# EAGLE design HARTShield (EAGLE 6.4)
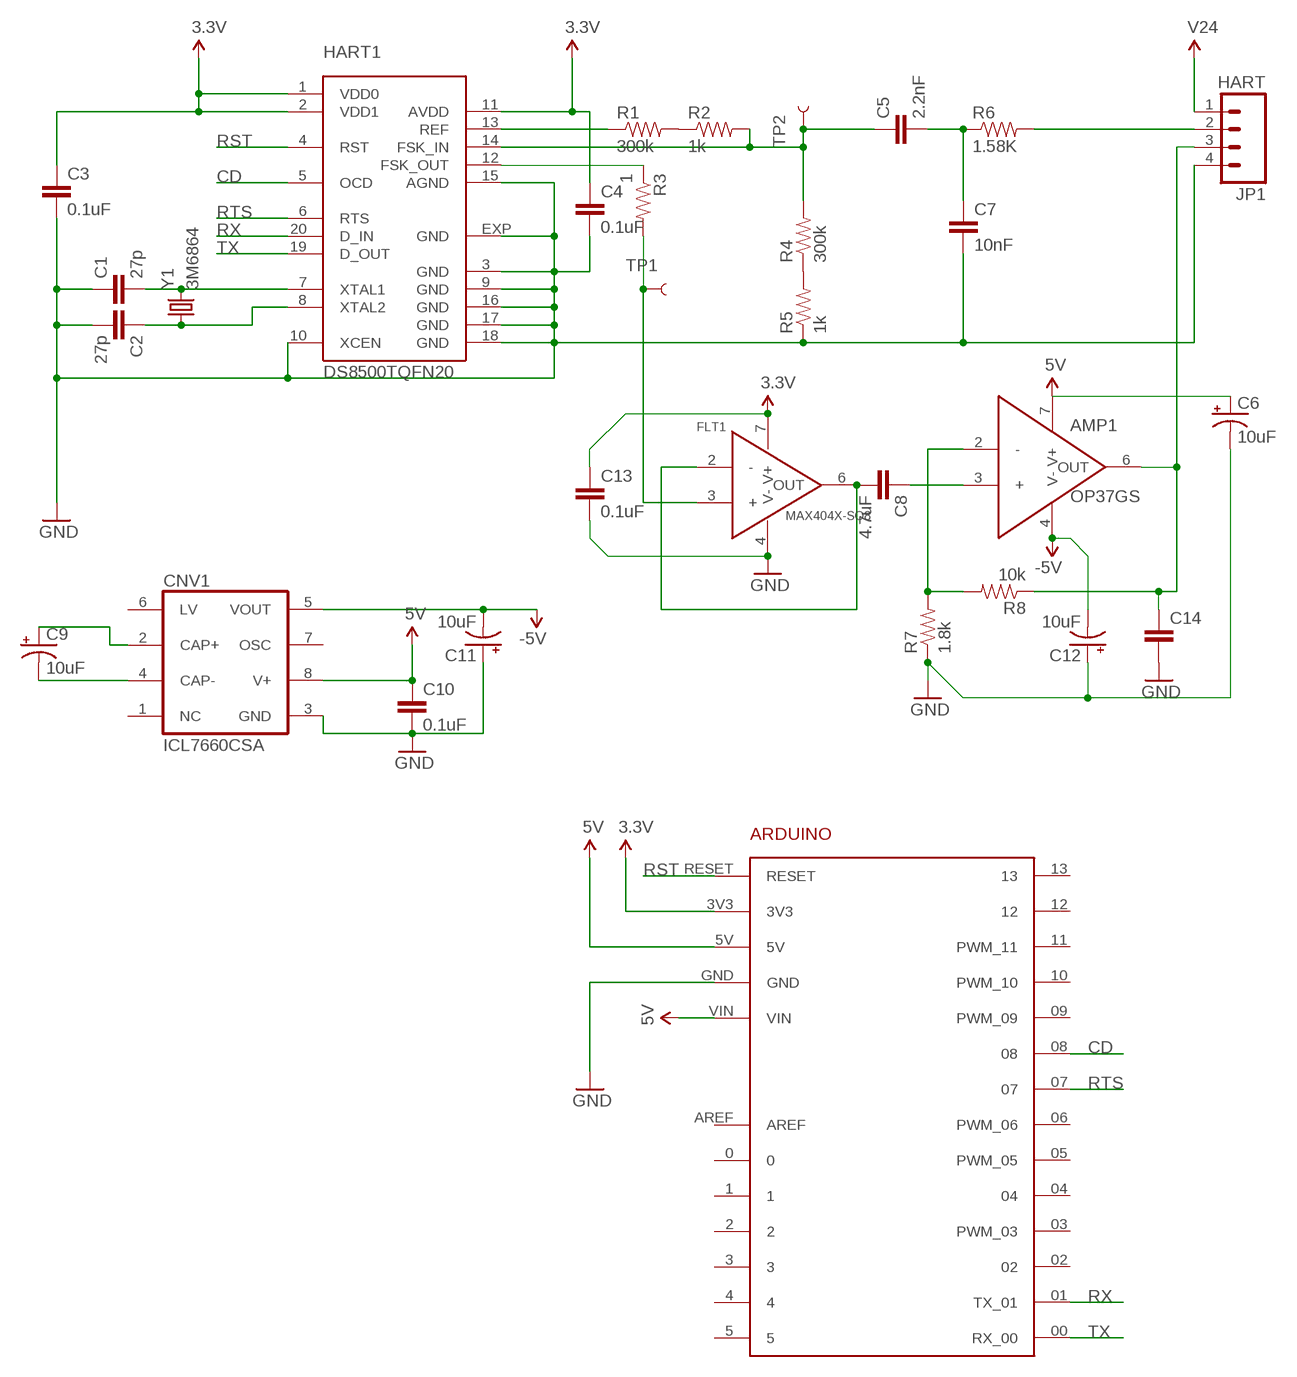
[diagram p0: schematic, sheet 1]

## Parts
AMP1  OP37GS  [SO8]
ARDUINO1  ARDUINO  [ARDUINO]
C1  27p  CAP0603-CAP  [0603-CAP]
C2  27p  CAP0603-CAP  [0603-CAP]
C3  0.1uF  0.1UF-25V(+80/-20%)(0603)  [0603-CAP]
C4  0.1uF  0.1UF-25V(+80/-20%)(0603)  [0603-CAP]
C5  2.2nF  0.1UF-25V(+80/-20%)(0603)  [0603-CAP]
C6  10uF  10UF-TANT  [EIA3216]
C7  10nF  0.1UF-25V(+80/-20%)(0603)  [0603-CAP]
C8  4.7uF  0.1UF-25V(+80/-20%)(0603)  [0603-CAP]
C9  10uF  10UF-TANT  [EIA3216]
C10  0.1uF  0.1UF-25V(+80/-20%)(0603)  [0603-CAP]
C11  10uF  10UF-TANT  [EIA3216]
C12  10uF  10UF-TANT  [EIA3216]
C13  0.1uF  0.1UF-50V-20%(PTH)KIT-EZ  [CAP-PTH-SMALL-KIT]
C14  0.1UF-50V-20%(PTH)KIT-EZ  [CAP-PTH-SMALL-KIT]
CNV1  ICL7660CSA  [SO08]
FLT1  MAX404X-SO8  [SO8]
HART1  DS8500TQFN20  [TQFN20-5X5]
JP1  HART  M04SCREW  [SCREWTERMINAL-3.5MM-4]
R1  300k  RESISTOR0805-RES  [0805]
R2  1k  RESISTOR0805-RES  [0805]
R3  1  RESISTOR1206  [1206]
R4  300k  RESISTOR0805-RES  [0805]
R5  1k  RESISTOR0805-RES  [0805]
R6  1.58K  RESISTOR0603  [0603-RES]
R7  1.8k  RESISTOR0805-RES  [0805]
R8  10k  RESISTOR0805-RES  [0805]
TP1  TEST-POINT2  [PAD.02X.02]
TP2  TEST-POINT2  [PAD.02X.02]
Y1  3M6864  CRYSTALSMD  [HC49UP]

## Nets
3.3V: ARDUINO1.3V3 C3.1 C4.1 C13.1 FLT1.7(V+) HART1.1(VDD0) HART1.2(VDD1) HART1.11(AVDD)
5V: AMP1.7(V+) ARDUINO1.5V ARDUINO1.VIN C6.A(+) C10.1 CNV1.8(V+)
CD: ARDUINO1.08 HART1.5(OCD)
GND: ARDUINO1.GND C1.1 C2.2 C3.2 C4.2 C6.C(-) C7.2 C10.2 C11.A(+) C12.A(+) C13.2 C14.2 CNV1.3(GND) FLT1.4(V-) HART1.3(GND) HART1.9(GND) HART1.10(XCEN) HART1.15(AGND) HART1.16(GND) HART1.17(GND) HART1.18(GND) HART1.EXP(GND) JP1.4 R5.1 R7.1
N$1: C2.1 HART1.8(XTAL2) Y1.1
N$2: C1.2 HART1.7(XTAL1) Y1.2
N$3: R1.2 R2.1
N$4: HART1.13(REF) R1.1
N$5: FLT1.3(+) R3.2 TP1.P$1
N$6: AMP1.3(+) C8.1
N$7: R4.1 R5.2
N$8: C5.1 HART1.14(FSK_IN) R2.2 R4.2 TP2.P$1
N$9: C5.2 C7.1 R6.1
N$10: C8.2 FLT1.2(-) FLT1.6(OUT)
N$11: JP1.2 R6.2
N$14: AMP1.6(OUT) C14.1 JP1.3 R8.1
N$15: AMP1.2(-) R7.2 R8.2
N$16: HART1.12(FSK_OUT) R3.1
N$18: C9.C(-) CNV1.4(CAP-)
N$19: C9.A(+) CNV1.2(CAP+)
RST: ARDUINO1.RESET HART1.4(RST)
RTS: ARDUINO1.07 HART1.6(RTS)
RX: ARDUINO1.01(TX_01) HART1.20(D_IN)
TX: ARDUINO1.00(RX_00) HART1.19(D_OUT)
VCC: JP1.1 ; supply symbol labelled V24
VNEG: AMP1.4(V-) C11.C(-) C12.C(-) CNV1.5(VOUT) ; supply symbol labelled -5V
Unconnected: ARDUINO1.0 ARDUINO1.1 ARDUINO1.02 ARDUINO1.2 ARDUINO1.3 ARDUINO1.03(PWM_03) ARDUINO1.4 ARDUINO1.04 ARDUINO1.5 ARDUINO1.05(PWM_05) ARDUINO1.06(PWM_06) ARDUINO1.09(PWM_09) ARDUINO1.10(PWM_10) ARDUINO1.11(PWM_11) ARDUINO1.12 ARDUINO1.13 ARDUINO1.AREF CNV1.1(NC) CNV1.6(LV) CNV1.7(OSC)

## Library data of the parts
AMP1 = hartmodems:OP37G: Ultraprecision amplifier
ARDUINO1 = post7_arduino:ARDUINO: For creating Arduino shields
C1 C2 = SparkFun-Capacitors:CAP: Capacitor Standard 0603 ceramic capacitor, and 0.1" leaded capacitor.
C3 C4 C10 = SparkFun-Capacitors:0.1UF-25V(+80/-20%)(0603): Ceramic Standard decoupling cap CAP-00810; PROD_ID: CAP-00810
C5 C7 C8 = SparkFun-Capacitors:0.1UF-25V(+80/-20%)(0603): Ceramic Standard decoupling cap CAP-00810; PROD_ID: CAP-00810; VALUE: 0.1uF
C6 C9 C11 C12 = SparkFun-Capacitors:10UF-TANT: 10uF Tantalum SMT CAP-00811- 16V 10% (EIA-3216); PROD_ID: CAP-00811
C13 C14 = SparkFun-Capacitors:0.1UF-50V-20%(PTH): CAP-08370; PROD_ID: CAP-08370
CNV1 = maxim:ICL7660CSA: VOLTAGE CONVERTER; MF: MAXIM; MPN: ICL7660CSA; OC_FARNELL: 9724710; OC_NEWARK: 34C3732
FLT1 = hartmodems:MAX404X: Rail-to-rail precise amp
HART1 = hartmodems:DS8500: Hart Modem
JP1 = SparkFun-Connectors:M04: Header 4 Standard 4-pin 0.1" header. Use with straight break away headers (SKU : PRT-00116), right angle break away headers (PRT-00553), swiss pins (PRT-00743), machine pins (PRT-00117), and female headers (PRT-00115). Molex polarized connector foot print use with SKU : PRT-08231 with associated crimp pins and housings. 1MM SMD Version SKU: PRT-10208
R1-R8 = SparkFun-Resistors:RESISTOR: Resistor Basic schematic elements and footprints for 0603, 1206, and PTH resistors.
TP1 TP2 = SparkFun-Passives:TEST-POINT: Bare copper test points for troubleshooting or ICT
Y1 = SparkFun-FreqCtrl:CRYSTAL: Various standard crystals. Proven footprints. Spark Fun Electronics SKU : COM-00534

## Board
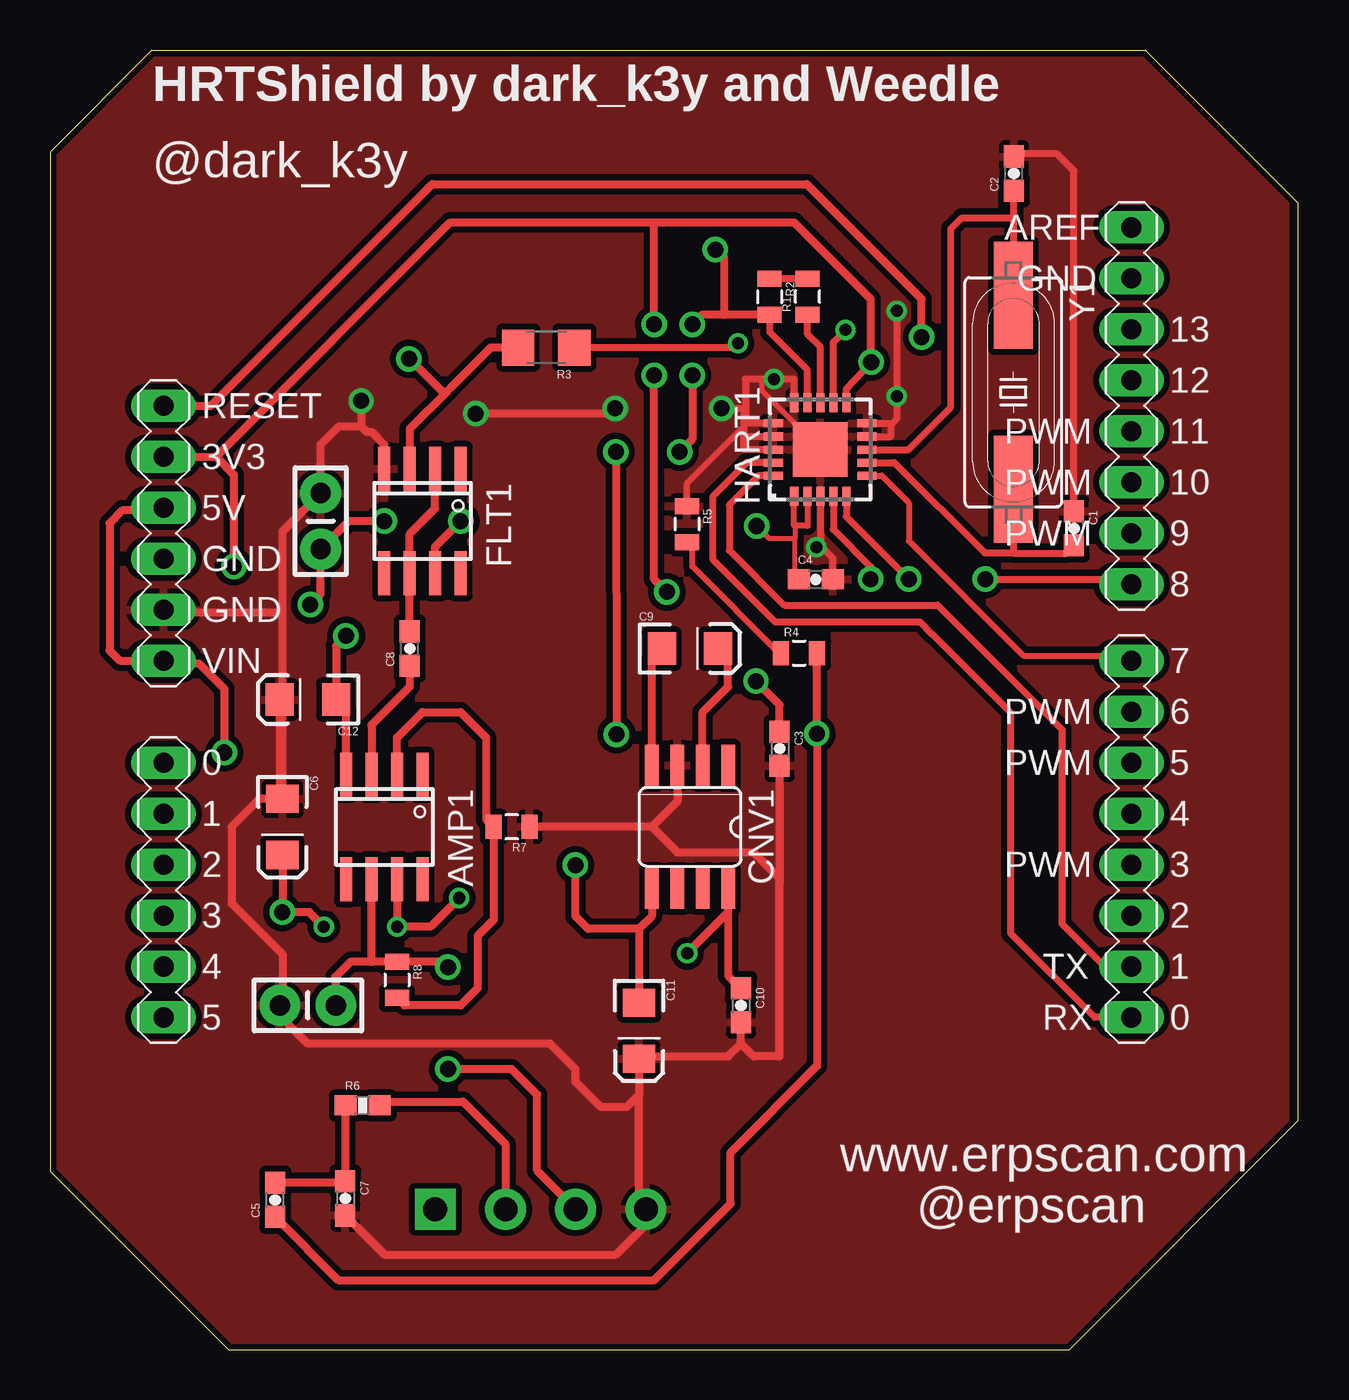
[diagram p1: board, top side]
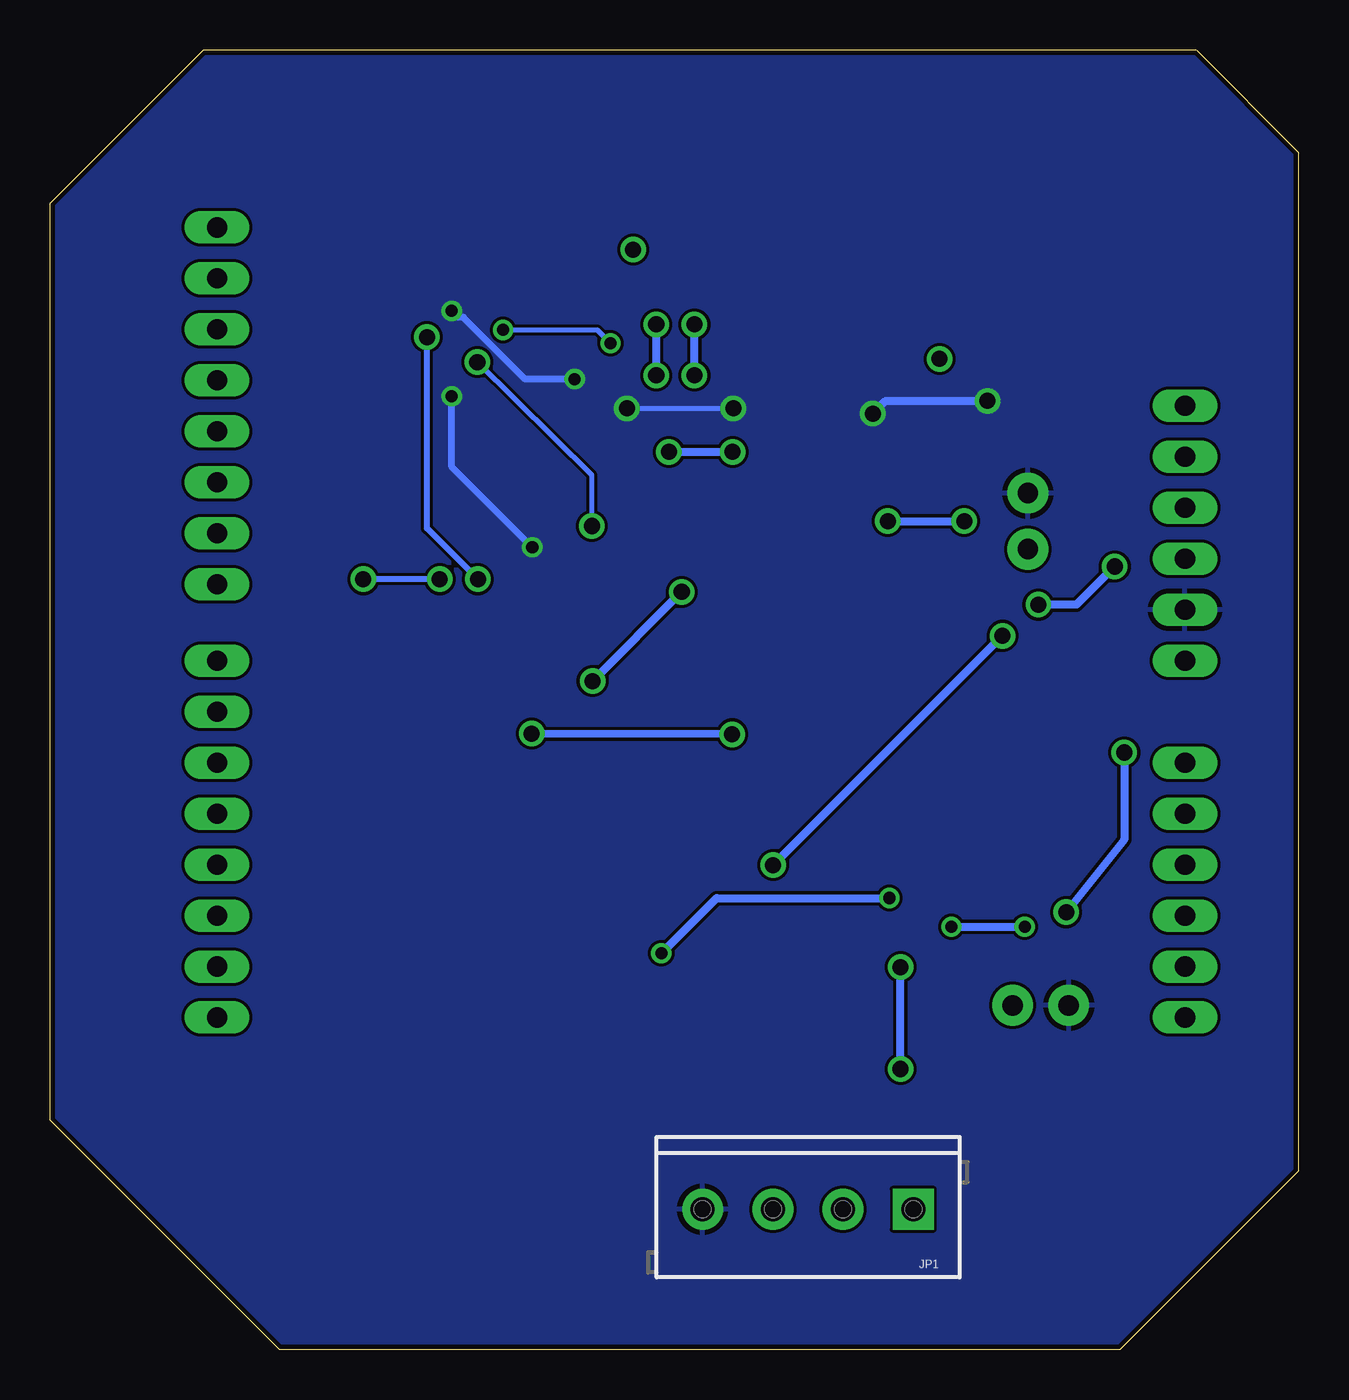
[diagram p2: board, bottom side, seen from below]

Size 62.23 x 64.77 mm. Coordinates in mm from the lower left corner, seen from the top.
Outline: 5.08,64.77 54.61,64.77 62.23,57.15 62.23,11.43 50.8,0 8.89,0 0,8.89 0,59.69 5.07,64.77
Copper layers (1*16): Top 0.035mm / dielectric 1.5mm / Bottom 0.035mm
Design rules "DFRobot_Eagle_Rule_v0.4": minimum track width 6mil, minimum drill 12mil, track to track 6mil, track to pad 6mil, pad to pad 6mil, via to via 6mil, smd to smd 0mil, copper to edge 10mil, drill to drill 10mil, minimum pad ring 12mil, minimum via ring 8mil, stop-mask expansion 2mil, vias tented up to drill 25mil, thermal gap 10mil

### Footprints (pad centres in the part's own frame; a part is rotated, then mirrored left to right if it is on the bottom)
SO8 = smd 0.6 x 2.2: 1 -1.905,-2.6; 2 -0.635,-2.6; 3 0.635,-2.6; 4 1.905,-2.6; 5 1.905,2.6; 6 0.635,2.6; 7 -0.635,2.6; 8 -1.905,2.6
ARDUINO = drill 1 long: 00 25.4,-20.32; 0 -22.86,-7.62; 01 25.4,-17.78; 1 -22.86,-10.16; 02 25.4,-15.24; 2 -22.86,-12.7; 03 25.4,-12.7; 3 -22.86,-15.24; 3V3 -22.86,7.62; 04 25.4,-10.16; 4 -22.86,-17.78; 05 25.4,-7.62; 5 -22.86,-20.32; 5V -22.86,5.08; 06 25.4,-5.08; 07 25.4,-2.54; 08 25.4,1.27; 09 25.4,3.81; 10 25.4,6.35; 11 25.4,8.89; 12 25.4,11.43; 13 25.4,13.97; AREF 25.4,19.05; GND -22.86,0; GND2 -22.86,2.54; GND3 25.4,16.51; RESET -22.86,10.16; VIN -22.86,-2.54
0603-CAP = smd 1.1 x 1: 1 -0.85,0; 2 0.85,0
EIA3216 = smd 1.4 x 1.6: A 1.4,0; C -1.4,0
CAP-PTH-SMALL-KIT = drill 1.016 pad 2.032: 1 -1.397,0; 2 1.397,0
SO08 = smd 0.66 x 2.032: 1 -1.905,-3.073; 2 -0.635,-3.073; 3 0.635,-3.073; 4 1.905,-3.073; 5 1.905,3.073; 6 0.635,3.073; 7 -0.635,3.073; 8 -1.905,3.073
TQFN20-5X5 = smd 0.95 x 0.4: 1 -2.325,1.3; 2 -2.325,0.65; 3 -2.325,0; 4 -2.325,-0.65; 5 -2.325,-1.3; 11 2.325,-1.3; 12 2.325,-0.65; 13 2.325,0; 14 2.325,0.65; 15 2.325,1.3 | smd 0.4 x 0.95: 6 -1.3,-2.325; 7 -0.65,-2.325; 8 0,-2.325; 9 0.65,-2.325; 10 1.3,-2.325; 16 1.3,2.325; 17 0.65,2.325; 18 0,2.325; 19 -0.65,2.325; 20 -1.3,2.325 | smd 2.7 x 2.7: EXP 0,0
SCREWTERMINAL-3.5MM-4 = drill 1.2 pad 2.032 square: 1 0,0 | drill 1.2 pad 2.032: 2 3.5,0; 3 7,0; 4 10.5,0
0805 = smd 0.8 x 1.2: 1 -0.9,0; 2 0.9,0
1206 = smd 1.6 x 1.8: 1 -1.4,0; 2 1.4,0
0603-RES = smd 1.1 x 1: 1 -0.85,0; 2 0.85,0
PAD.02X.02 = smd 0.508 x 0.508: P$1 0,0
HC49UP = smd 5.334 x 1.93: 1 -4.826,0; 2 4.826,0

### Placement (x,y rotation side)
AMP1  16.66,26.06 180 top
ARDUINO1  28.51,36.88 0 top
C1  51.05,40.94 270 top
C2  48.05,58.62 90 top
C3  36.37,29.96 270 top
C4  38.17,38.4 0 top
C5  11.22,7.48 90 top
C6  11.58,26.06 270 top
C7  14.72,7.55 270 top
C8  17.93,34.95 90 top
C9  31.9,34.95 0 top
C10  34.44,17.17 270 top
C11  29.36,15.9 270 top
C12  12.85,32.41 180 top
C13  13.48,41.3 90 top
C14  12.85,17.17 180 top
CNV1  31.9,26.06 180 top
FLT1  18.56,41.3 180 top
HART1  38.39,44.87 90 top
JP1  19.2,7.01 180 bottom
R1  37.76,52.49 90 top
R2  35.87,52.48 270 top
R3  24.73,49.95 180 top
R4  37.34,34.72 0 top
R5  31.75,41.15 270 top
R6  15.58,12.19 0 top
R7  23.01,26.06 180 top
R8  17.29,18.44 270 top
TP1  17.88,49.44 0 top
TP2  33.2,54.84 90 top
Y1  48.02,47.72 270 top

### Tracks (layer width: path | path; a pad name or v marks a point on that pad's centre or on a via)
3.3V  (via drill 0.8 pad 1.27)
  Top 0.254: 37.12,41.06 37.12,40.42 | C4.1 37.24,38.4 37.12,38.52 37.12,40.42 | 37.12,40.42 35.85,40.42 v35.22,41.06
  Top 0.305: HART1.2 37.76,42.53 37.76,41.06 37.12,41.06 37.09,41.09 HART1.1
  Top 0.35: HART1.11 39.69,47.89 v40.93,49.23
  Top 0.406: FLT1.7 19.2,40.03 v20.47,41.3 | v16.66,41.3 14.88,41.3 C13.1 13.48,37.66 v12.96,37.13 | ARDUINO1.3V3 8.27,44.5 | 8.27,44.5 19.95,56.18 30.11,56.18 | 30.11,56.18 37.09,56.18 40.9,52.37 40.9,49.77 v40.93,49.23 | 8.27,44.5 9.15,43.62 v9.15,39.04 | C3.1 36.37,32.14 v35.19,33.32 | v30.74,37.77 30.11,38.4 v30.11,48.56 | v30.11,51.1 30.11,56.18
  Bottom 0.254: v35.22,41.06 35.22,43.6 v40.93,49.23
  Bottom 0.406: v20.47,41.3 v16.66,41.3 | v9.15,39.04 11.06,37.13 v12.96,37.13 | v35.19,33.32 v30.74,37.77 | v30.11,48.56 v30.11,51.1
5V  (via drill 0.6, 0.8 pad 1.27)
  Top 0.406: ARDUINO1.5V 5.52,41.83 3.6,41.83 2.96,41.2 2.96,34.85 3.47,34.34 ARDUINO1.VIN 5.78,34.21 7.41,34.21 8.68,32.94 v8.68,29.77 | C6.A 11.58,21.62 11.58,21.85 v11.57,21.81 12.92,21.81 v13.64,21.09 | C10.1 33.8,18.66 CNV1.8 33.8,21.8 v31.76,19.76 | v20.39,22.52 18.96,21.09 v17.3,21.09 AMP1.7
  Bottom 0.406: v8.68,29.77 8.68,25.42 v11.57,21.81 | v31.76,19.76 29,22.52 v20.39,22.52 | v17.3,21.09 v13.64,21.09
CD  (via drill 0.8 pad 1.27)
  Top 0.35: HART1.5 39.69,41.52 v42.81,38.4 | v46.62,38.4 53.66,38.4 ARDUINO1.08
  Bottom 0.305: v42.81,38.4 v46.62,38.4
GND  (via drill 0.6, 0.6 pad 0.3, 0.8 pad 1.27)
  Top 0.25: HART1.EXP 35.49,47.78 35.49,48.38
  Top 0.254: 48.06,59.46 C2.2
  Top 0.305: 34.58,46.14 34.58,46.02 31.75,43.19 R5.1
  Top 0.35: HART1.10 41.91,46.17 41.91,46.1 | 41.91,46.1 41.91,45.52 HART1.9 | HART1.16 34.66,46.17 | 34.66,46.17 34.58,46.17 | 34.58,46.17 34.58,46.02 34.58,45.52 | HART1.17 34.58,45.52 | 34.58,45.52 34.58,44.87 HART1.18 | HART1.15 37.1,48.38 v36.08,48.38 35.49,48.38 34.66,48.38 34.66,46.17 | 38.94,38.47 C4.2 39.01,38.41 39.01,39.47 38.39,40.08 HART1.3 38.39,40.16 38.24,40 v38.19,40 | v33.48,46.92 34.58,46.92 34.58,46.17 | v42.21,51.77 42.21,47.6 v42.21,47.52 42.21,46.4 41.91,46.1 | C1.1 51.05,58.75 50.2,59.59 48.18,59.59 C2.2
  Top 0.406: FLT1.4 16.66,45.11 16.02,45.74 15.78,45.74 15.5,46.02 | C12.A 11.45,27.59 C6.C | C6.C 11.58,36.75 | 11.58,36.75 11.58,40.79 C13.2 13.48,45.11 14.4,46.02 15.5,46.02 | C6.C 10.44,27.46 9.04,26.06 9.04,22.25 11.58,19.71 11.58,17.3 C14.2 11.45,16.66 12.85,15.26 24.91,15.26 26.18,13.99 26.18,13.36 27.45,12.09 28.72,12.09 29.36,12.72 | CNV1.3 31.26,27.33 29.99,26.06 | 29.99,26.06 R7.1 | 29.36,12.72 C11.A 29.49,14.63 33.8,14.63 34.44,15.26 | 34.44,15.26 C10.2 | 29.99,26.06 31.26,24.79 35.07,24.79 36.34,23.52 36.34,23.16 | 36.34,23.16 36.34,14.63 35.07,14.63 34.44,15.26 | 29.36,12.72 29.36,7.35 JP1.4 29.7,6.25 28.2,4.75 16.66,4.75 C7.2 | ARDUINO1.GND 5.78,36.75 11.58,36.75 | C3.2 36.37,23.19 36.34,23.16 | v28.17,46.92 27.91,46.66 v21.22,46.66 | v15.5,47.29 15.5,46.02
  Bottom 0.254: v33.48,46.92 v28.17,46.92
  Bottom 0.35: v36.08,48.38 38.55,48.38 41.64,51.46 41.9,51.46 v42.21,51.77 | v38.19,40 42.21,44.01 v42.21,47.52
  Bottom 0.406: v21.22,46.66 20.58,47.29 v15.5,47.29
  pour Top (isolate 0.305): 0,59.69 0,9.53 9.52,0 50.8,0 61.59,10.79 61.59,57.15 53.97,64.77 5.08,64.77
  pour Bottom: 0,59.69 5.08,64.77 54.61,64.77 62.23,57.15 62.23,11.43 50.8,0 8.89,0 0,8.89
N$1
  Top 0.254: 48.01,52.55 Y1.1 48.15,52.42 48.15,51.44 48.05,51.53
  Top 0.35: 48.05,51.53 48.05,56.42 | 48.05,56.42 C2.1 | HART1.8 42.79,44.87 44.9,46.98 44.9,55.86 45.46,56.42 48.05,56.42
N$2
  Top 0.254: 47.98,40.43 47.98,42.86 Y1.2 48.02,40.52 | 50.66,39.71 C1.2
  Top 0.35: 48.02,40.52 48.02,39.71 | 48.02,39.71 50.66,39.71 | HART1.7 42.08,44.22 46.59,39.71 48.01,39.71 48.02,39.71
N$3
  Top 0.254: R2.1
  Top 0.35: R1.2 R2.1
N$4
  Top 0.35: HART1.13 38.39,49.98 37.76,50.62 R1.1
N$5
  Top 0.305: FLT1.3 17.93,44.75 | 19.8,47.78 19.95,47.93
  Top 0.406: 17.93,44.75 17.93,45.91 19.8,47.78 19.54,47.78 TP1.P$1 | R3.2 21.97,49.95 19.95,47.93
N$6
  Top 0.406: C8.1 17.93,33.05 16.02,31.14 AMP1.3
N$7
  Top 0.305: R4.1 36.33,34.73 32.01,39.04 32.01,39.98 R5.2
N$8  (via drill 0.8 pad 1.27)
  Top 0.35: HART1.14 37.74,48.84 35.88,50.71 R2.2
  Top 0.406: R2.2 33.58,51.58 | 33.58,51.58 32.49,51.58 v32.01,51.1 | v32.01,48.56 32.01,45.39 v31.38,44.75 | v28.2,44.75 v28.23,30.68 | R4.2 v38.22,30.71 38.24,14.15 33.92,9.83 33.92,7.29 30.11,3.48 14.37,3.48 C5.1 | TP2.P$1 33.58,54.46 33.58,51.58
  Bottom 0.406: v32.01,51.1 v32.01,48.56 | v31.38,44.75 v28.2,44.75 | v28.23,30.68 v38.22,30.71
N$9
  Top 0.406: R6.1 14.72,12.17 C7.1 14.65,8.33 C5.2
N$10
  Top 0.406: FLT1.2 19.2,41.93 17.93,40.66 FLT1.6 C8.2
N$11
  Top 0.406: R6.2 16.62,12.37 20.58,12.37 22.7,10.25 JP1.2
N$12  (via drill 0.8 pad 1.27)
  other vias: 17.89,49.39
N$13  (via drill 0.8 pad 1.27)
  other vias: 33.17,54.83
N$14  (via drill 0.8 pad 1.27)
  Top 0.406: JP1.3 24.28,8.93 24.28,12.72 23.01,13.99 v19.83,13.99 | v19.83,19.08 19.46,19.34 R8.1 16.01,19.34 | 16.01,19.34 14.97,19.34 14.23,18.6 14.23,17.19 C14.1 | AMP1.6 16.01,19.34
  Bottom 0.406: v19.83,13.99 v19.83,19.08
N$15
  Top 0.406: AMP1.2 17.29,30.5 18.56,31.77 20.47,31.77 21.74,30.5 21.74,26.43 R7.2 22.11,21.43 21.32,20.64 21.32,18.02 20.47,17.17 17.66,17.17 R8.2
N$16  (via drill 0.6)
  Top 0.254: 26.24,49.84 R3.1
  Top 0.35: HART1.12 39.04,50.22 v39.65,50.83 | v34.29,50.16 34.07,49.95 R3.1
  Bottom 0.254: v39.65,50.83 34.95,50.83 v34.29,50.16
N$18
  Top 0.406: CNV1.4 29.99,34.45 C9.C
N$19
  Top 0.406: CNV1.2 32.53,31.77 33.8,33.05 33.8,34.45 C9.A
RST  (via drill 0.8 pad 1.27)
  Top 0.35: HART1.4 39.04,40.89 40.9,39.04 v40.9,38.41 v40.9,38.4
  Top 0.406: v43.44,50.47 43.44,52.37 37.72,58.09 19.05,58.09 8,47.04 ARDUINO1.RESET
  Bottom 0.305: v40.9,38.4 43.44,40.94 v43.44,50.47
RTS
  Top 0.305: HART1.6 41.46,43.57 42.81,42.21 42.81,40.31 48.52,34.59 53.66,34.59 ARDUINO1.07
RX
  Top 0.35: HART1.20 35.32,43.57 33.86,42.11 33.86,39.84 36.59,37.12 44.25,37.12 50.44,30.92 50.44,21.22 52.56,19.1 ARDUINO1.01
TX
  Top 0.35: HART1.19 34.71,44.22 33.05,42.55 33.05,39.37 36.15,36.26 43.38,36.26 43.99,35.64 44,35.64 47.9,31.74 47.9,20.74 52.07,16.56 ARDUINO1.00
VNEG  (via drill 0.8 pad 1.27)
  Top 0.406: AMP1.4 14.75,31.91 C12.C 14.25,35.08 v14.75,35.59 | CNV1.5 29.99,21.62 29.36,20.98 | 29.36,20.98 26.82,20.98 26.18,21.62 v26.18,24.16 | 29.36,20.98 C11.C
  Bottom 0.406: v26.18,24.16 v14.75,35.59

### Text on the board
tNames: HRTShield by dark_k3y and Weedle | @dark_k3y | www.erpscan.com | @erpscan